# EAGLE design srf (EAGLE 5.02)
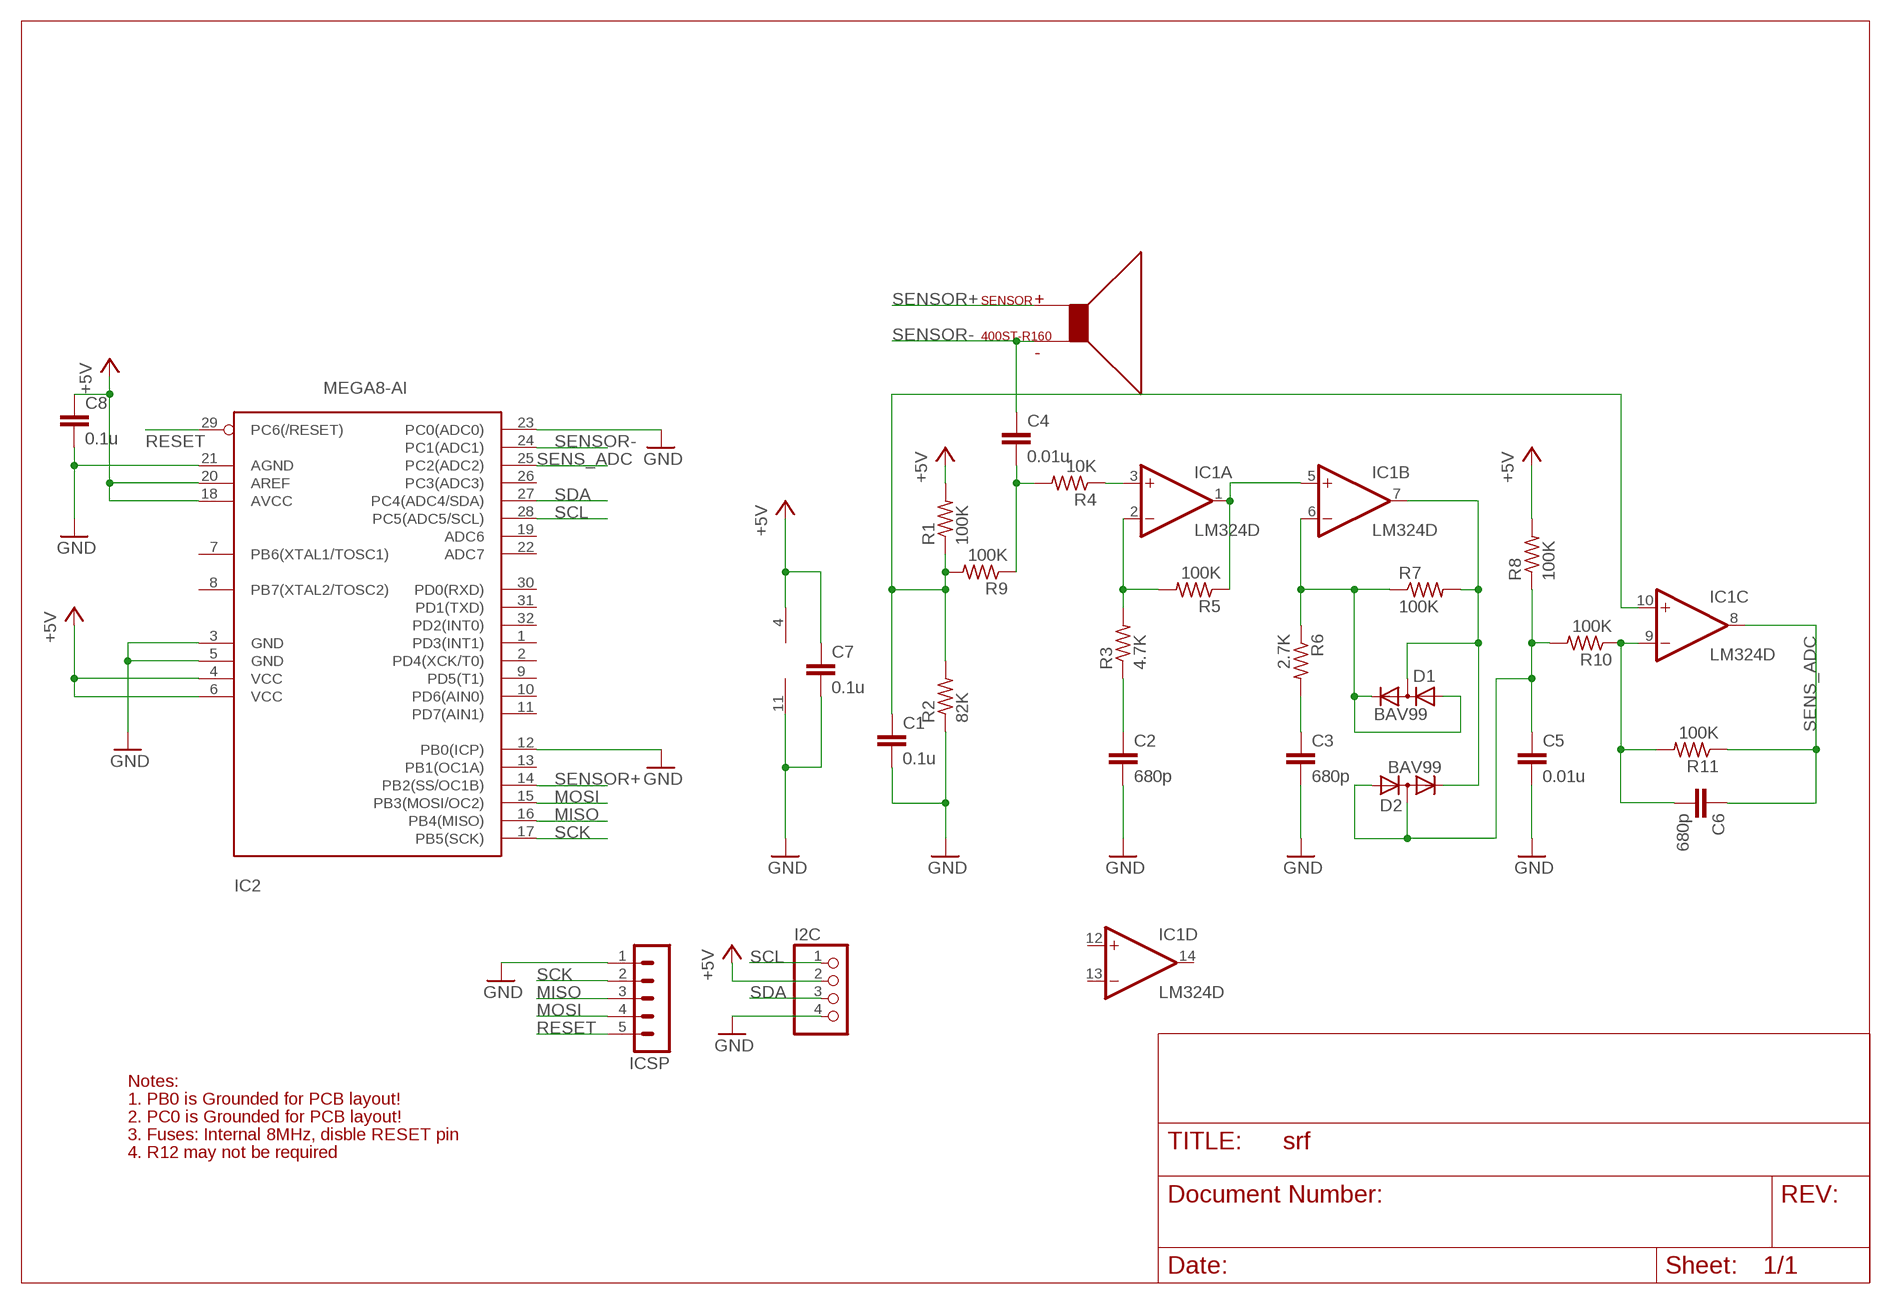
[diagram p0: schematic, sheet 1]

## Parts
C1  0.1u  C-EUC0603  [C0603]
C2  680p  C-EUC0805  [C0805]
C3  680p  C-EUC1206  [C1206]
C4  0.01u  C-EUC1206  [C1206]
C5  0.01u  C-EUC0805  [C0805]
C6  680p  C-EUC0805  [C0805]
C7  0.1u  C-EUC0603  [C0603]
C8  0.1u  C-EUC0805  [C0805]
D1  BAV99  BAV199  [SOT23]
D2  BAV99  BAV199  [SOT23]
I2C  PINHD-1X4  [1X04]
IC1  LM324D  [SO14]
IC2  MEGA8-AI  [TQFP32-08]
ICSP  MA05-1SMD  [MA05-1SMD-0.1]
R1  100K  R-US_R0603  [R0603]
R2  82K  R-US_R0603  [R0603]
R3  4.7K  R-US_R2012  [R2012]
R4  10K  R-US_R2012  [R2012]
R5  100K  R-US_R2012  [R2012]
R6  2.7K  R-US_R2012  [R2012]
R7  100K  R-US_R2012  [R2012]
R8  100K  R-US_R2012  [R2012]
R9  100K  R-US_R0603  [R0603]
R10  100K  R-US_R2012  [R2012]
R11  100K  R-US_R2012  [R2012]
SENSOR  400ST-R160  [400STR160]

## Nets
+5V: C7.1 C8.1 I2C.2 IC1.4(P:V+) IC2.4(VCC) IC2.6(VCC) IC2.18(AVCC) IC2.20(AREF) R1.2 R8.2
GND: C1.2 C2.2 C3.2 C5.2 C7.2 C8.2 I2C.4 IC1.11(P:V-) IC2.3(GND) IC2.5(GND) IC2.12(PB0(ICP)) IC2.21(AGND) IC2.23(PC0(ADC0)) ICSP.1 R2.1
MISO: IC2.16(PB4(MISO)) ICSP.3
MOSI: IC2.15(PB3(MOSI/OC2)) ICSP.4
N$1: C1.1 IC1.10(C:+IN) R1.1 R2.2 R9.2
N$2: C4.2 R4.2 R9.1
N$3: IC1.3(A:+IN) R4.1
N$4: IC1.2(A:-IN) R3.2 R5.2
N$5: C2.1 R3.1
N$6: IC1.1(A:OUT) IC1.5(B:+IN) R5.1
N$7: C3.1 R6.2
N$9: D1.3(AC) D2.2(C) IC1.7(B:OUT) R7.2
N$10: C5.1 D2.1(A) D2.3(AC) R8.1 R10.2
N$11: C6.2 IC1.9(C:-IN) R10.1 R11.2
N$13: D1.1(A) D1.2(C) IC1.6(B:-IN) R6.1 R7.1
RESET: IC2.29(PC6(/RESET)) ICSP.5
SCK: IC2.17(PB5(SCK)) ICSP.2
SCL: I2C.1 IC2.28(PC5(ADC5/SCL))
SDA: I2C.3 IC2.27(PC4(ADC4/SDA))
SENS_ADC: C6.1 IC1.8(C:OUT) IC2.25(PC2(ADC2)) R11.1
SENSOR+: IC2.14(PB2(SS/OC1B)) SENSOR.P$1
SENSOR-: C4.1 IC2.24(PC1(ADC1)) SENSOR.P$2
Unconnected: IC1.12(D:+IN) IC1.13(D:-IN) IC1.14(D:OUT) IC2.1(PD3(INT1)) IC2.2(PD4(XCK/T0)) IC2.7(PB6(XTAL1/TOSC1)) IC2.8(PB7(XTAL2/TOSC2)) IC2.9(PD5(T1)) IC2.10(PD6(AIN0)) IC2.11(PD7(AIN1)) IC2.13(PB1(OC1A)) IC2.19(ADC6) IC2.22(ADC7) IC2.26(PC3(ADC3)) IC2.30(PD0(RXD)) IC2.31(PD1(TXD)) IC2.32(PD2(INT0))

## Notes on the sheet
- Notes:
- 1. PB0 is Grounded for PCB layout!
- 2. PC0 is Grounded for PCB layout!
- 3. Fuses: Internal 8MHz, disble RESET pin
- 4. R12 may not be required

## Library data of the parts
C1-C8 = rcl:C-EU: CAPACITOR, European symbol
D1 D2 = diode:BAV199: DIODE low-leakage double diode
I2C = pinhead:PINHD-1X4: PIN HEADER
IC1 = linear:LM324: OP AMP
IC2 = atmel:MEGA8: MICROCONTROLLER 8 Kbytes FLASH, 1 kbytes SRAM, 512 bytes EEPROM, USART, 6-channel 10 bit ADC, 2-channel 8 bit ADC Pin compatible with Atmega48, ATMega88, ATMega168 Source: avr.lbr
ICSP = con-lstb:MA05-1SMD
R1-R11 = rcl:R-US_: RESISTOR, American symbol
SENSOR = ultrasonic_transducer-1:400ST-R160

## Board
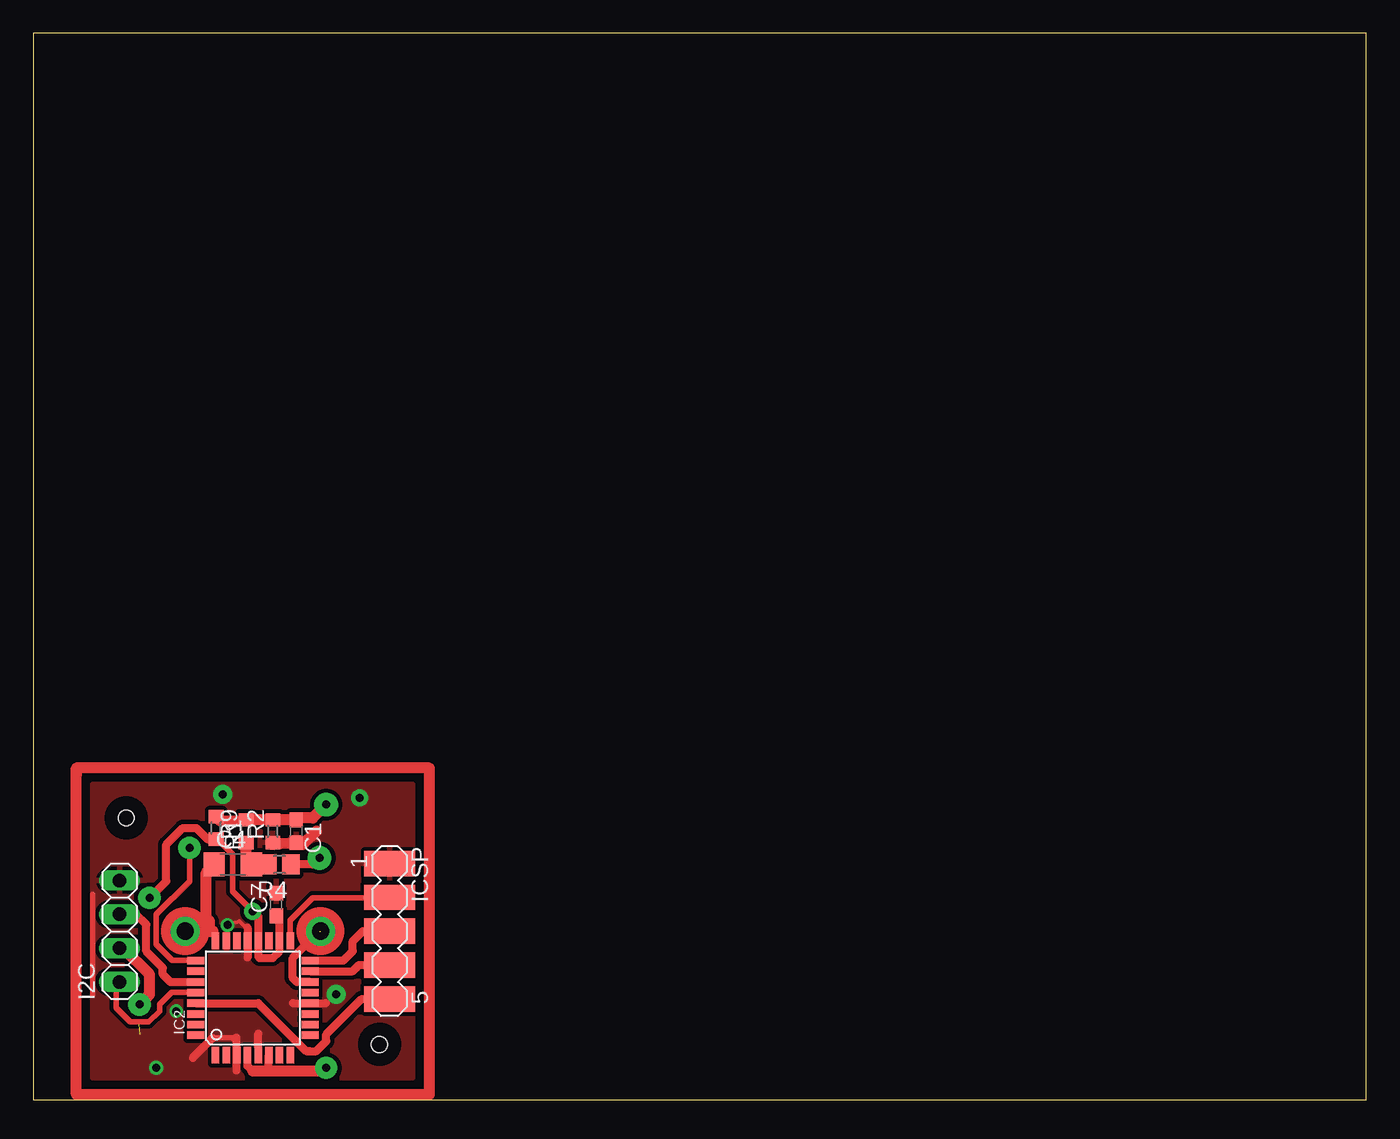
[diagram p1: board, top side]
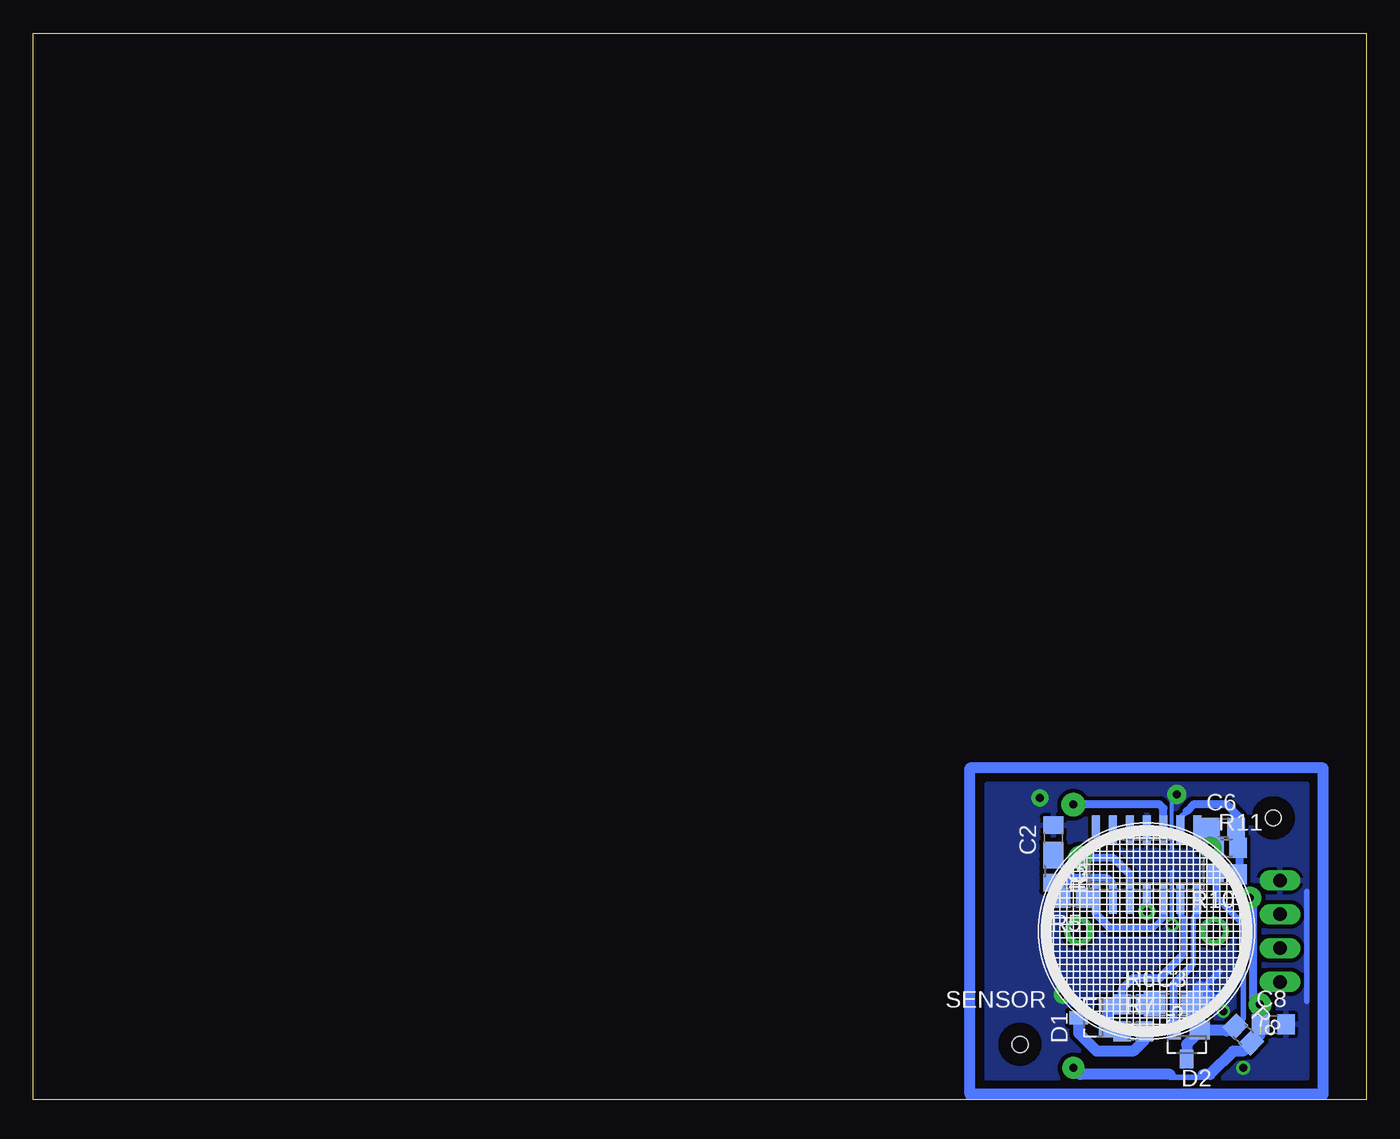
[diagram p2: board, bottom side, seen from below]

Size 100 x 80 mm. Coordinates in mm from the lower left corner, seen from the top.
Outline: 0,0 100,0 100,80 0,80 0,0
Copper layers (1*16): Top 0.035mm / dielectric 1.5mm / Bottom 0.035mm
Design rules "default": minimum track width 10mil, minimum drill 24mil, track to track 8mil, track to pad 8mil, pad to pad 8mil, via to via 8mil, smd to smd 8mil, copper to edge 40mil, drill to drill 8mil, minimum pad ring 10mil, minimum via ring 8mil, stop-mask expansion 4mil, vias tented up to drill 0mil, thermal gap 10mil
Holes 1.2 mm at 25.97,4.13 6.97,21.13

### Footprints (pad centres in the part's own frame; a part is rotated, then mirrored left to right if it is on the bottom)
C0603 = smd 1.1 x 1: 1 -0.85,0; 2 0.85,0
C0805 = smd 1.3 x 1.5: 1 -0.95,0; 2 0.95,0
C1206 = smd 1.6 x 1.8: 1 -1.4,0; 2 1.4,0
SOT23 = smd 1 x 1.4: 1 -0.95,-1.1; 2 0.95,-1.1; 3 0,1.1
1X04 = drill 1.016 long: 1 -3.81,0; 2 -1.27,0; 3 1.27,0; 4 3.81,0
SO14 = smd 0.6 x 2.2: 1 -3.81,-2.6; 2 -2.54,-2.6; 3 -1.27,-2.6; 4 0,-2.6; 5 1.27,-2.6; 6 2.54,-2.6; 7 3.81,-2.6; 8 3.81,2.6; 9 2.54,2.6; 10 1.27,2.6; 11 0,2.6; 12 -1.27,2.6; 13 -2.54,2.6; 14 -3.81,2.6
TQFP32-08 = smd 1.27 x 0.559: 1 -4.293,2.8; 2 -4.293,2; 3 -4.293,1.2; 4 -4.293,0.4; 5 -4.293,-0.4; 6 -4.293,-1.2; 7 -4.293,-2; 8 -4.293,-2.8; 17 4.293,-2.8; 18 4.293,-2; 19 4.293,-1.2; 20 4.293,-0.4; 21 4.293,0.4; 22 4.293,1.2; 23 4.293,2; 24 4.293,2.8 | smd 0.559 x 1.27: 9 -2.8,-4.293; 10 -2,-4.293; 11 -1.2,-4.293; 12 -0.4,-4.293; 13 0.4,-4.293; 14 1.2,-4.293; 15 2,-4.293; 16 2.8,-4.293; 25 2.8,4.293; 26 2,4.293; 27 1.2,4.293; 28 0.4,4.293; 29 -0.4,4.293; 30 -1.2,4.293; 31 -2,4.293; 32 -2.8,4.293
MA05-1SMD-0.1 = smd 1.905 x 3.81: 1 -5.08,0; 2 -2.54,0; 3 0,0; 4 2.54,0; 5 5.08,0
R0603 = smd 1 x 1.1: 1 -0.85,0; 2 0.85,0
R2012 = smd 1.3 x 1.5: 1 -0.85,0; 2 0.85,0
400STR160 = drill 1.3 pad 2.184 round: P$1 5.08,0; P$2 -5.08,0

### Placement (x,y rotation side)
C1  19.72,20.13 270 top
C2  23.47,19.63 90 bottom
C3  14.47,7.13 0 bottom
C4  14.97,17.63 0 top
C5  12.47,6.13 90 bottom
C6  10.72,20.38 0 bottom
C7  18.23,14.63 90 top
C8  6.96,5.63 0 bottom
D1  20.47,6.13 90 bottom
D2  13.47,4.14 180 bottom
I2C  6.47,12.63 90 top
IC1  16.47,17.63 0 bottom
IC2  16.47,7.63 90 top
ICSP  26.72,12.63 270 top
R1  13.72,20.38 270 top
R2  17.97,20.13 90 top
R3  23.47,17.13 270 bottom
R4  18.47,17.63 180 top
R5  21.98,15.13 180 bottom
R6  17.47,7.13 0 bottom
R7  17.47,5.14 0 bottom
R8  9.22,4.88 315 bottom
R9  15.97,20.13 90 top
R10  10.47,16.88 180 bottom
R11  10.47,18.88 0 bottom
SENSOR  16.47,12.63 180 bottom

### Tracks (layer width: path | path; a pad name or v marks a point on that pad's centre or on a via)
+5V  (via drill 0.6 pad 1.27, 0.6 pad 1.68)  (1 unrouted)
  Top 0.406: 17.47,2.13 17.67,2.33 | 16.87,10.73 16.97,10.63 | R1.2 14.07,19.28 14.97,18.38 14.97,15.63 v16.47,14.13 | 8.47,7.63 7.9,7.06 | C7.1 18.48,13.64 18.47,13.63 | 18.47,11.63 IC2.18 | v21.97,2.38 21.97,2.03
  Top 0.61: 17.67,2.33 IC2.6 | 16.87,10.73 IC2.20 16.87,13.73 v16.47,14.13 | 16.97,10.63 17.97,10.63 18.47,11.13 IC2.18 | 18.47,11.63 18.47,13.63 | IC2.4 16.07,2.53 16.47,2.13 | R1.2 13.07,19.53 12.22,20.38 11.22,20.38 9.97,19.13 9.97,16.38 v8.72,15.13
  Top 0.813: 16.47,2.13 17.47,2.13 21.72,2.13 v21.97,2.38 | v7.97,7.13 8.47,7.63 8.72,7.88 8.72,9.38 6.74,11.36 I2C.2
  Bottom 0.406: IC1.4 16.47,15.13 v16.47,14.13 | C8.1 7.9,5.81 | 12.22,1.88 12.34,1.69 14.66,1.69 14.72,1.88 | R8.2 8.62,4.78 9.22,3.63
  Bottom 0.61: v8.72,15.13 8.47,14.88 8.47,7.63 v7.97,7.13
  Bottom 0.813: v21.97,2.38 21.47,1.88 14.72,1.88 | 12.22,1.88 11.72,1.88 9.97,3.63 9.22,3.63 7.97,4.88 v7.97,7.13
GND  (via drill 0.6, 0.6 pad 1.02, 0.6 pad 1.27, 0.6 pad 1.42)
  Top 0.305: 15.97,12.89 16.08,12.89 | IC2.21 15.97,11.92 15.97,12.89 | 15.97,12.89 15.47,13.38 14.47,13.13 v14.57,13.1
  Top 0.406: 18.02,19.18 17.97,19.13 R2.1 19.82,19.28 19.97,19.13 | IC2.3 15.27,4.33 14.97,4.63 13.47,4.63 | 16.87,3.88 16.97,3.88 16.87,3.78 IC2.5 | 4.47,7.88 4.47,15.38
  Top 0.61: 11.97,3.13 13.47,4.63 | 19.46,7.23 21.96,7.23 | 15.25,2.16 15.25,4.66 | 16.87,4.97 16.87,3.88 16.87,3.47 | 16.08,12.89 16.08,10.64
  Top 0.813: 18.02,19.18 C1.2 | 19.97,19.13 20.22,19.13 21.22,20.13
  Bottom 0.305: 14.57,18.66 14.57,22.41 | 14.47,17.13 14.57,17.09 v14.57,13.09 14.6,13.13 14.72,13.13 14.47,12.88
  Bottom 0.406: C5.2 12.92,7.08 12.97,7.13 C3.2 13.07,7.53 10.97,9.63 | 4.47,7.38 4.47,15.63 | v10.72,6.63 10.97,6.63 11.47,7.13 | 11.47,7.38 10.97,7.88
  Bottom 1: 11.47,7.13 11.47,7.38 12.47,8.38
  other vias: 24.47,22.63 9.22,2.38 14.22,22.88 22.72,7.88
  pour Top (isolate 0.305): 4.47,1.63 20.36,1.63 28.47,9.74 28.47,23.63 4.47,23.63
  pour Bottom (isolate 0.305): 28.47,1.63 28.47,23.63 4.47,23.63 4.47,9.94 12.78,1.63
  pour Bottom (isolate 0.305): 4.47,1.63 11.97,1.63 4.47,9.13
MISO
  Top 0.61: ICSP.3 24.72,12.63 23.97,11.88 23.97,11.13 23.27,10.43 IC2.16
MOSI
  Top 0.406: 24.22,9.88 24.43,10.09
  Top 0.61: IC2.15 23.97,9.63 24.22,9.88 24.43,10.09 ICSP.4
N$1  (via drill 0.6 pad 1.78)
  Top 0.406: 15.97,21.13 | R9.2 15.97,21.13 | 15.97,21.13 15.82,20.98 | 17.97,21.13 | R2.2 17.97,21.13 | 17.97,21.13 17.82,20.98 | 19.82,20.98 19.97,21.13 C1.1
  Top 0.813: 17.82,20.98 R9.2 15.97,20.88 14.07,20.88 R1.1 | 19.82,20.98 R2.2 | v21.97,22.13 20.97,21.13 19.97,21.13
  Bottom 0.61: IC1.10 15.2,21.86 15.47,22.13 v21.97,22.13
N$2
  Top 0.406: 16.47,17.13 R4.2 | 16.47,17.13 | 15.97,17.63 C4.2 16.37,17.23 16.47,17.13
  Top 0.813: 15.97,17.63 R9.1
N$3  (via drill 0.6 pad 1.78)
  Top 0.61: R4.1 20.97,17.63 v21.47,18.13
  Bottom 0.61: v21.47,18.13 18.97,18.13 17.74,16.9 IC1.3
N$4
  Bottom 0.406: 22.97,15.88 22.97,15.13 R5.2 22.83,15.49 23.47,16.13 R3.2
  Bottom 0.61: IC1.2 19.01,16.17 19.47,16.63 22.22,16.63 22.97,15.88
N$5
  Bottom 0.406: C2.1 23.47,18.63 R3.1
N$6
  Bottom 0.406: IC1.5 15.2,13.65 15.97,12.88 16.47,12.88 | IC1.1 20.37,15.03 20.47,15.13 R5.1
  Bottom 0.61: 16.47,12.88 19.22,12.88 20.28,13.94 IC1.1
N$7
  Bottom 0.406: R6.2 16.47,7.13 C3.1
N$9
  Bottom 0.406: R7.2 16.48,5.14 16.47,5.13 16.36,5.24 | 13.22,9.88 12.97,10.13 12.97,13.63 12.66,13.94 IC1.7
  Bottom 0.61: 16.36,5.24 D2.2 14.42,8.68 13.22,9.88
  Bottom 0.813: D1.3 21.57,4.98 20.22,3.63 17.47,3.63 16.61,4.49 R7.2
N$10
  Bottom 0.406: 10.47,5.13 10.52,5.18 | 9.82,5.28 R8.1 9.22,6.08 9.22,13.13 11.22,15.13 11.22,16.88 R10.2 | 12.47,5.13 C5.1 12.47,5.38 12.52,5.33 D2.1
  Bottom 0.813: R8.1 10.47,5.13 | 10.52,5.18 C5.1 | D2.3 13.47,4.13 12.47,5.13
N$11
  Bottom 0.406: 9.47,18.63 R11.2 | 9.47,20.63 | 9.62,20.48 9.47,20.63 | 9.47,20.63 C6.2 | IC1.9 13.93,20.17 | 9.47,20.63 9.47,21.13 | 9.47,16.63 | R10.1 9.47,16.63 | 9.47,16.63 9.47,17.13 | IC1.9 13.97,20.27 | 13.47,21.63 13.97,21.13 13.97,20.13 IC1.9
  Bottom 0.61: R11.2 9.62,20.48 | 9.47,21.13 10.47,22.13 12.97,22.13 13.47,21.63 | 9.47,17.13 9.47,18.63
N$12
  Top 0.813: 3.22,24.38 3.22,24.63 | 3.22,24.38 3.22,0.38 29.72,0.38 29.72,24.88 3.22,24.88 3.22,24.38
N$13
  Bottom 0.406: D1.2 19.42,7.08 19.47,7.13 R6.1 | R7.1 18.46,5.14 18.47,5.13 18.52,5.18 D1.1 19.42,5.18 | 19.42,5.18 19.47,5.13 | 19.42,5.18 19.37,5.23 | 13.93,10.67 13.68,10.92 13.68,13.59 13.72,13.63 13.93,13.84 IC1.6
  Bottom 0.61: 13.93,10.67 15.47,9.13 17.47,9.13 18.32,8.28 R6.1
  Bottom 0.813: 19.37,5.23 D1.2
N$15
  Bottom 0.813: 3.22,24.88 29.72,24.88 29.72,0.38 3.22,0.38 3.22,24.88
N$17
  pour Top (isolate 0.305): 19.97,1.63 28.47,10.13 28.47,1.63
RESET
  Top 0.406: 20.72,3.63 20.72,3.73
  Top 0.61: IC2.29 16.87,7.23 20.47,3.63 20.72,3.63 21.22,3.63 21.97,4.38 21.97,4.88 24.64,7.55 ICSP.5
SCK
  Top 0.406: 26.47,15.13 | 26.47,15.13 20.97,15.13 19.27,13.43 IC2.17
  Top 0.61: ICSP.2 26.72,15.13 26.47,15.13
SCL
  Top 0.406: I2C.1 6.47,8.63 6.22,8.38 6.22,6.88 7.27,5.83 8.67,5.83 9.47,6.63 9.47,7.13 10.37,8.03 IC2.28
SDA
  Top 0.61: I2C.3 7.7,13.9 8.47,13.13 8.47,11.13 9.72,9.88 9.72,9.38 10.27,8.83 IC2.27
SENS_ADC  (via drill 0.6 pad 1.68)
  Top 0.406: v11.72,18.88 11.72,16.38 9.22,13.88 9.22,11.63 10.42,10.43 IC2.25
  Bottom 0.406: 11.82,18.88 R11.1 | 11.82,18.88 11.32,19.63 | 11.32,19.63 11.32,20.48 11.47,20.63 | 11.47,20.63 | 11.47,20.63 C6.1 | 11.32,19.63 11.47,20.13 11.57,20.23 IC1.8 | v11.72,18.88 11.82,18.88
SENSOR+  (1 unrouted)
  Top 0.61: IC2.14 19.77,8.83 19.47,9.13 19.47,10.63 21.47,12.63
SENSOR-
  Top 0.305: SENSOR.P$2 11.47,12.63
  Top 0.406: IC2.24 13.67,12.43 13.47,12.63 13.52,12.68 | 11.47,12.63 | 13.47,17.63 | 13.47,17.63 C4.1 | 13.52,17.58 13.47,17.63
  Top 0.813: 11.47,12.63 13.22,12.63 | 13.22,12.63 13.47,12.63 | 13.52,17.58 12.97,17.03 12.97,13.63 13.22,13.38 13.22,12.63
(copper drawn outside any net)
  shapes: Bottom area x1, Top circle x2